# Altium schematic sheet OverView.SchDoc
size A3; Organization: Altium Limited; Address1: L3, 12a Rodborough Rd; Address2: Frenchs Forest; Address3: NSW; Address4: Australia 2086
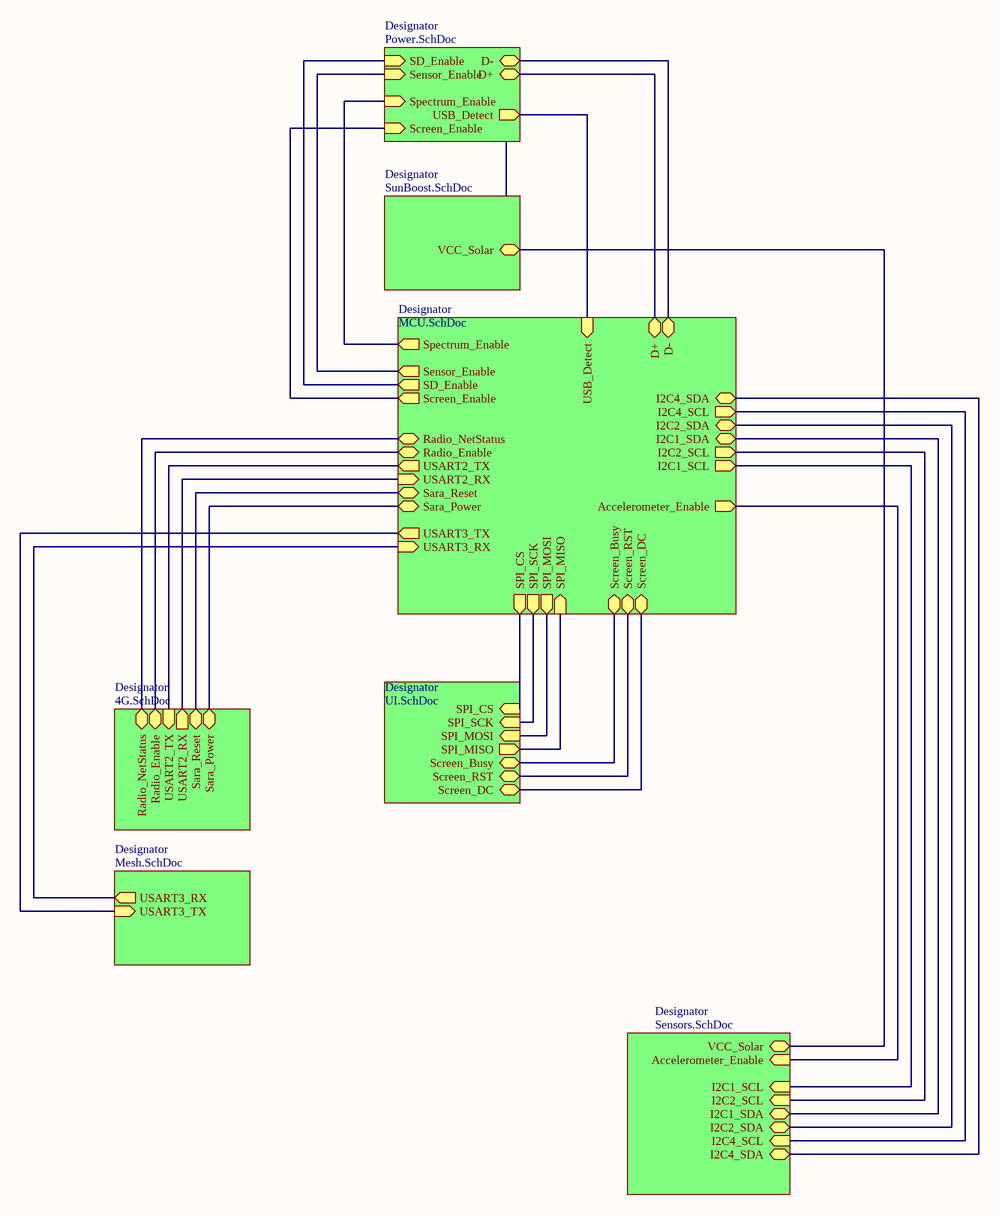
[diagram p0: OverView.SchDoc]

## Sub-sheets
Designator = MCU.SchDoc: Sensor_Enable (out), SD_Enable (out), SPI_CS (out), Radio_Enable (bidir), USART2_TX (out), SPI_SCK (out), USART3_RX (in), USART2_RX (in), USART3_TX (out), SPI_MISO (in), Radio_NetStatus (bidir), SPI_MOSI (out), Accelerometer_Enable (out), I2C1_SCL (out), I2C2_SCL (out), I2C1_SDA (bidir), I2C2_SDA (bidir), I2C4_SDA (bidir), I2C4_SCL (out), USB_Detect (in), Spectrum_Enable (out), Sara_Reset (bidir), Sara_Power (bidir), Screen_Enable (out), Screen_Busy (bidir), Screen_RST (bidir), Screen_DC (bidir), D- (bidir), D+ (bidir)
Designator = Sensors.SchDoc: VCC_Solar (bidir), Accelerometer_Enable (in), I2C1_SCL (in), I2C2_SCL (in), I2C1_SDA (bidir), I2C2_SDA (bidir), I2C4_SCL (in), I2C4_SDA (bidir)
Designator = Power.SchDoc: Sensor_Enable (in), SD_Enable (in), USB_Detect (out), Spectrum_Enable (in), Screen_Enable (in), D- (bidir), D+ (bidir)
Designator = SunBoost.SchDoc: VCC_Solar (bidir)
Designator = 4G.SchDoc: Radio_NetStatus (bidir), Radio_Enable (bidir), USART2_TX (in), USART2_RX (out), Sara_Reset (bidir), Sara_Power (bidir)
Designator = UI.SchDoc: SPI_CS (in), SPI_SCK (in), SPI_MOSI (in), SPI_MISO (out), Screen_Busy (bidir), Screen_DC (bidir), Screen_RST (bidir)
Designator = Mesh.SchDoc: USART3_TX (in), USART3_RX (out)

## Nets
(unnamed): sheet Designator/Sensor_Enable, sheet Designator/Sensor_Enable
(unnamed): sheet Designator/SD_Enable, sheet Designator/SD_Enable
(unnamed): sheet Designator/SPI_CS, sheet Designator/SPI_CS
(unnamed): sheet Designator/Radio_Enable, sheet Designator/Radio_Enable
(unnamed): sheet Designator/USART2_TX, sheet Designator/USART2_TX
(unnamed): sheet Designator/SPI_SCK, sheet Designator/SPI_SCK
(unnamed): sheet Designator/USART3_RX, sheet Designator/USART3_RX
(unnamed): sheet Designator/USART2_RX, sheet Designator/USART2_RX
(unnamed): sheet Designator/USART3_TX, sheet Designator/USART3_TX
(unnamed): sheet Designator/SPI_MISO, sheet Designator/SPI_MISO
(unnamed): sheet Designator/Radio_NetStatus, sheet Designator/Radio_NetStatus
(unnamed): sheet Designator/SPI_MOSI, sheet Designator/SPI_MOSI
(unnamed): sheet Designator/Accelerometer_Enable, sheet Designator/Accelerometer_Enable
(unnamed): sheet Designator/I2C1_SCL, sheet Designator/I2C1_SCL
(unnamed): sheet Designator/I2C2_SCL, sheet Designator/I2C2_SCL
(unnamed): sheet Designator/I2C1_SDA, sheet Designator/I2C1_SDA
(unnamed): sheet Designator/I2C2_SDA, sheet Designator/I2C2_SDA
(unnamed): sheet Designator/I2C4_SDA, sheet Designator/I2C4_SDA
(unnamed): sheet Designator/I2C4_SCL, sheet Designator/I2C4_SCL
(unnamed): sheet Designator/USB_Detect, sheet Designator/USB_Detect
(unnamed): sheet Designator/Spectrum_Enable, sheet Designator/Spectrum_Enable
(unnamed): sheet Designator/Sara_Reset, sheet Designator/Sara_Reset
(unnamed): sheet Designator/Sara_Power, sheet Designator/Sara_Power
(unnamed): sheet Designator/Screen_Enable, sheet Designator/Screen_Enable
(unnamed): sheet Designator/Screen_Busy, sheet Designator/Screen_Busy
(unnamed): sheet Designator/Screen_RST, sheet Designator/Screen_RST
(unnamed): sheet Designator/Screen_DC, sheet Designator/Screen_DC
(unnamed): sheet Designator/D-, sheet Designator/D-
(unnamed): sheet Designator/D+, sheet Designator/D+
(unnamed): sheet Designator/VCC_Solar, sheet Designator/VCC_Solar

## Notes on the sheet
- Title
- Size:
- Date:
- A3
- Number:
- Time:
- Revision:
- Sheet
- of
- File: